# Altium schematic sheet motor.SchDoc
size A4
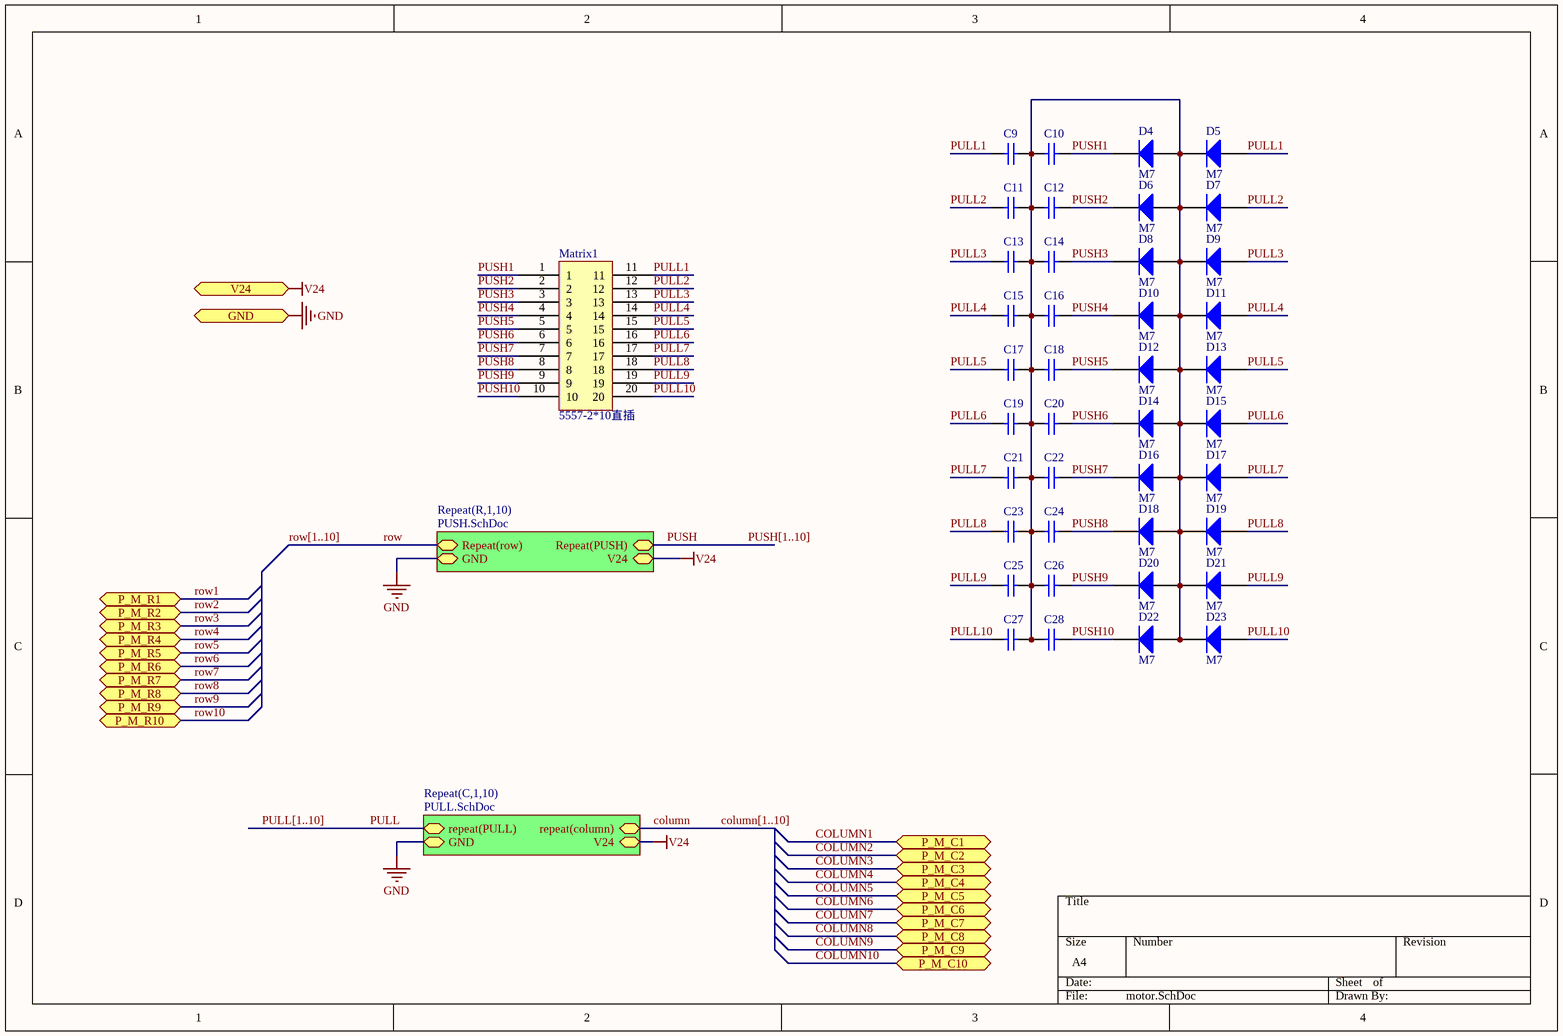
[diagram p0: motor.SchDoc]

## Parts
C9  100nF(104) 10% 50V  [0805_C]  (value not drawn)
C10  100nF(104) 10% 50V  [0805_C]  (value not drawn)
C11  100nF(104) 10% 50V  [0805_C]  (value not drawn)
C12  100nF(104) 10% 50V  [0805_C]  (value not drawn)
C13  100nF(104) 10% 50V  [0805_C]  (value not drawn)
C14  100nF(104) 10% 50V  [0805_C]  (value not drawn)
C15  100nF(104) 10% 50V  [0805_C]  (value not drawn)
C16  100nF(104) 10% 50V  [0805_C]  (value not drawn)
C17  100nF(104) 10% 50V  [0805_C]  (value not drawn)
C18  100nF(104) 10% 50V  [0805_C]  (value not drawn)
C19  100nF(104) 10% 50V  [0805_C]  (value not drawn)
C20  100nF(104) 10% 50V  [0805_C]  (value not drawn)
C21  100nF(104) 10% 50V  [0805_C]  (value not drawn)
C22  100nF(104) 10% 50V  [0805_C]  (value not drawn)
C23  100nF(104) 10% 50V  [0805_C]  (value not drawn)
C24  100nF(104) 10% 50V  [0805_C]  (value not drawn)
C25  100nF(104) 10% 50V  [0805_C]  (value not drawn)
C26  100nF(104) 10% 50V  [0805_C]  (value not drawn)
C27  100nF(104) 10% 50V  [0805_C]  (value not drawn)
C28  100nF(104) 10% 50V  [0805_C]  (value not drawn)
D4  M7  [SMA(DO-214AC)_S1]
D5  M7  [SMA(DO-214AC)_S1]
D6  M7  [SMA(DO-214AC)_S1]
D7  M7  [SMA(DO-214AC)_S1]
D8  M7  [SMA(DO-214AC)_S1]
D9  M7  [SMA(DO-214AC)_S1]
D10  M7  [SMA(DO-214AC)_S1]
D11  M7  [SMA(DO-214AC)_S1]
D12  M7  [SMA(DO-214AC)_S1]
D13  M7  [SMA(DO-214AC)_S1]
D14  M7  [SMA(DO-214AC)_S1]
D15  M7  [SMA(DO-214AC)_S1]
D16  M7  [SMA(DO-214AC)_S1]
D17  M7  [SMA(DO-214AC)_S1]
D18  M7  [SMA(DO-214AC)_S1]
D19  M7  [SMA(DO-214AC)_S1]
D20  M7  [SMA(DO-214AC)_S1]
D21  M7  [SMA(DO-214AC)_S1]
D22  M7  [SMA(DO-214AC)_S1]
D23  M7  [SMA(DO-214AC)_S1]
Matrix1  5557-2*10直插  [5557_2*10]

## Sub-sheets
Repeat(C,1,10) = PULL.SchDoc: repeat(PULL), GND, repeat(column), V24
Repeat(R,1,10) = PUSH.SchDoc: Repeat(PUSH), V24, Repeat(row), GND

## Ports
GND, P_M_C1, P_M_C2, P_M_C3, P_M_C4, P_M_C5, P_M_C6, P_M_C7, P_M_C8, P_M_C9, P_M_C10, P_M_R1, P_M_R2, P_M_R3, P_M_R4, P_M_R5, P_M_R6, P_M_R7, P_M_R8, P_M_R9, P_M_R10, V24

## Nets
GND: port GND, sheet Repeat(C,1,10)/GND, sheet Repeat(R,1,10)/GND
V24: port V24, sheet Repeat(C,1,10)/V24, sheet Repeat(R,1,10)/V24
column: sheet Repeat(C,1,10)/repeat(column)
COLUMN1: port P_M_C1
COLUMN2: port P_M_C2
COLUMN3: port P_M_C3
COLUMN4: port P_M_C4
COLUMN5: port P_M_C5
COLUMN6: port P_M_C6
COLUMN7: port P_M_C7
COLUMN8: port P_M_C8
COLUMN9: port P_M_C9
COLUMN10: port P_M_C10
PULL: sheet Repeat(C,1,10)/repeat(PULL)
PULL1: C9.1 D5.1(A) Matrix1.11
PULL2: C11.1 D7.1(A) Matrix1.12
PULL3: C13.1 D9.1(A) Matrix1.13
PULL4: C15.1 D11.1(A) Matrix1.14
PULL5: C17.1 D13.1(A) Matrix1.15
PULL6: C19.1 D15.1(A) Matrix1.16
PULL7: C21.1 D17.1(A) Matrix1.17
PULL8: C23.1 D19.1(A) Matrix1.18
PULL9: C25.1 D21.1(A) Matrix1.19
PULL10: C27.1 D23.1(A) Matrix1.20
PUSH: sheet Repeat(R,1,10)/Repeat(PUSH)
PUSH1: C10.2 D4.2(K) Matrix1.1
PUSH2: C12.2 D6.2(K) Matrix1.2
PUSH3: C14.2 D8.2(K) Matrix1.3
PUSH4: C16.2 D10.2(K) Matrix1.4
PUSH5: C18.2 D12.2(K) Matrix1.5
PUSH6: C20.2 D14.2(K) Matrix1.6
PUSH7: C22.2 D16.2(K) Matrix1.7
PUSH8: C24.2 D18.2(K) Matrix1.8
PUSH9: C26.2 D20.2(K) Matrix1.9
PUSH10: C28.2 D22.2(K) Matrix1.10
row: sheet Repeat(R,1,10)/Repeat(row)
row1: port P_M_R1
row2: port P_M_R2
row3: port P_M_R3
row4: port P_M_R4
row5: port P_M_R5
row6: port P_M_R6
row7: port P_M_R7
row8: port P_M_R8
row9: port P_M_R9
row10: port P_M_R10
NetC9_2: C9.2 C10.1 C11.2 C12.1 C13.2 C14.1 C15.2 C16.1 C17.2 C18.1 C19.2 C20.1 C21.2 C22.1 C23.2 C24.1 C25.2 C26.1 C27.2 C28.1 D4.1(A) D5.2(K) D6.1(A) D7.2(K) D8.1(A) D9.2(K) D10.1(A) D11.2(K) D12.1(A) D13.2(K) D14.1(A) D15.2(K) D16.1(A) D17.2(K) D18.1(A) D19.2(K) D20.1(A) D21.2(K) D22.1(A) D23.2(K)

## Buses and harness runs
bus column[1..10]
bus PULL[1..10]
bus PUSH[1..10]
bus row[1..10]

## Library data of the parts
C9-C28 = 0805 100nF(104) 10% 50V: 贴片电容; ComponentLink1Description: 供应商链接; ComponentLink1URL: http://www.szlcsc.com/product/details_50686.html; Package: 0805; Supplier: LC; SuppliersPartNumber: C49678
D4-D23 = SMA(DO-214AC) M7: 二极管; 备注: 1N4007 4007 编号C2464 已经停售, 使用新物料编号C95872; ComponentLink1Description: 供应商链接; ComponentLink1URL: http://www.szlcsc.com/product/details_2841.html; Package: SMA(DO-214AC); Supplier: LC; SuppliersPartNumber: C95872